# Altium schematic sheet 01_USB_B_and_Power.SchDoc: USB 3.0 Type-B Interface & 3.3 V Power
size A4; DrawnBy: Caoilte Donohoe; Revision: A0; SheetNumber: 1; SheetTotal: 4; Project Name: USB3 Gigabit Ethernet Adapter
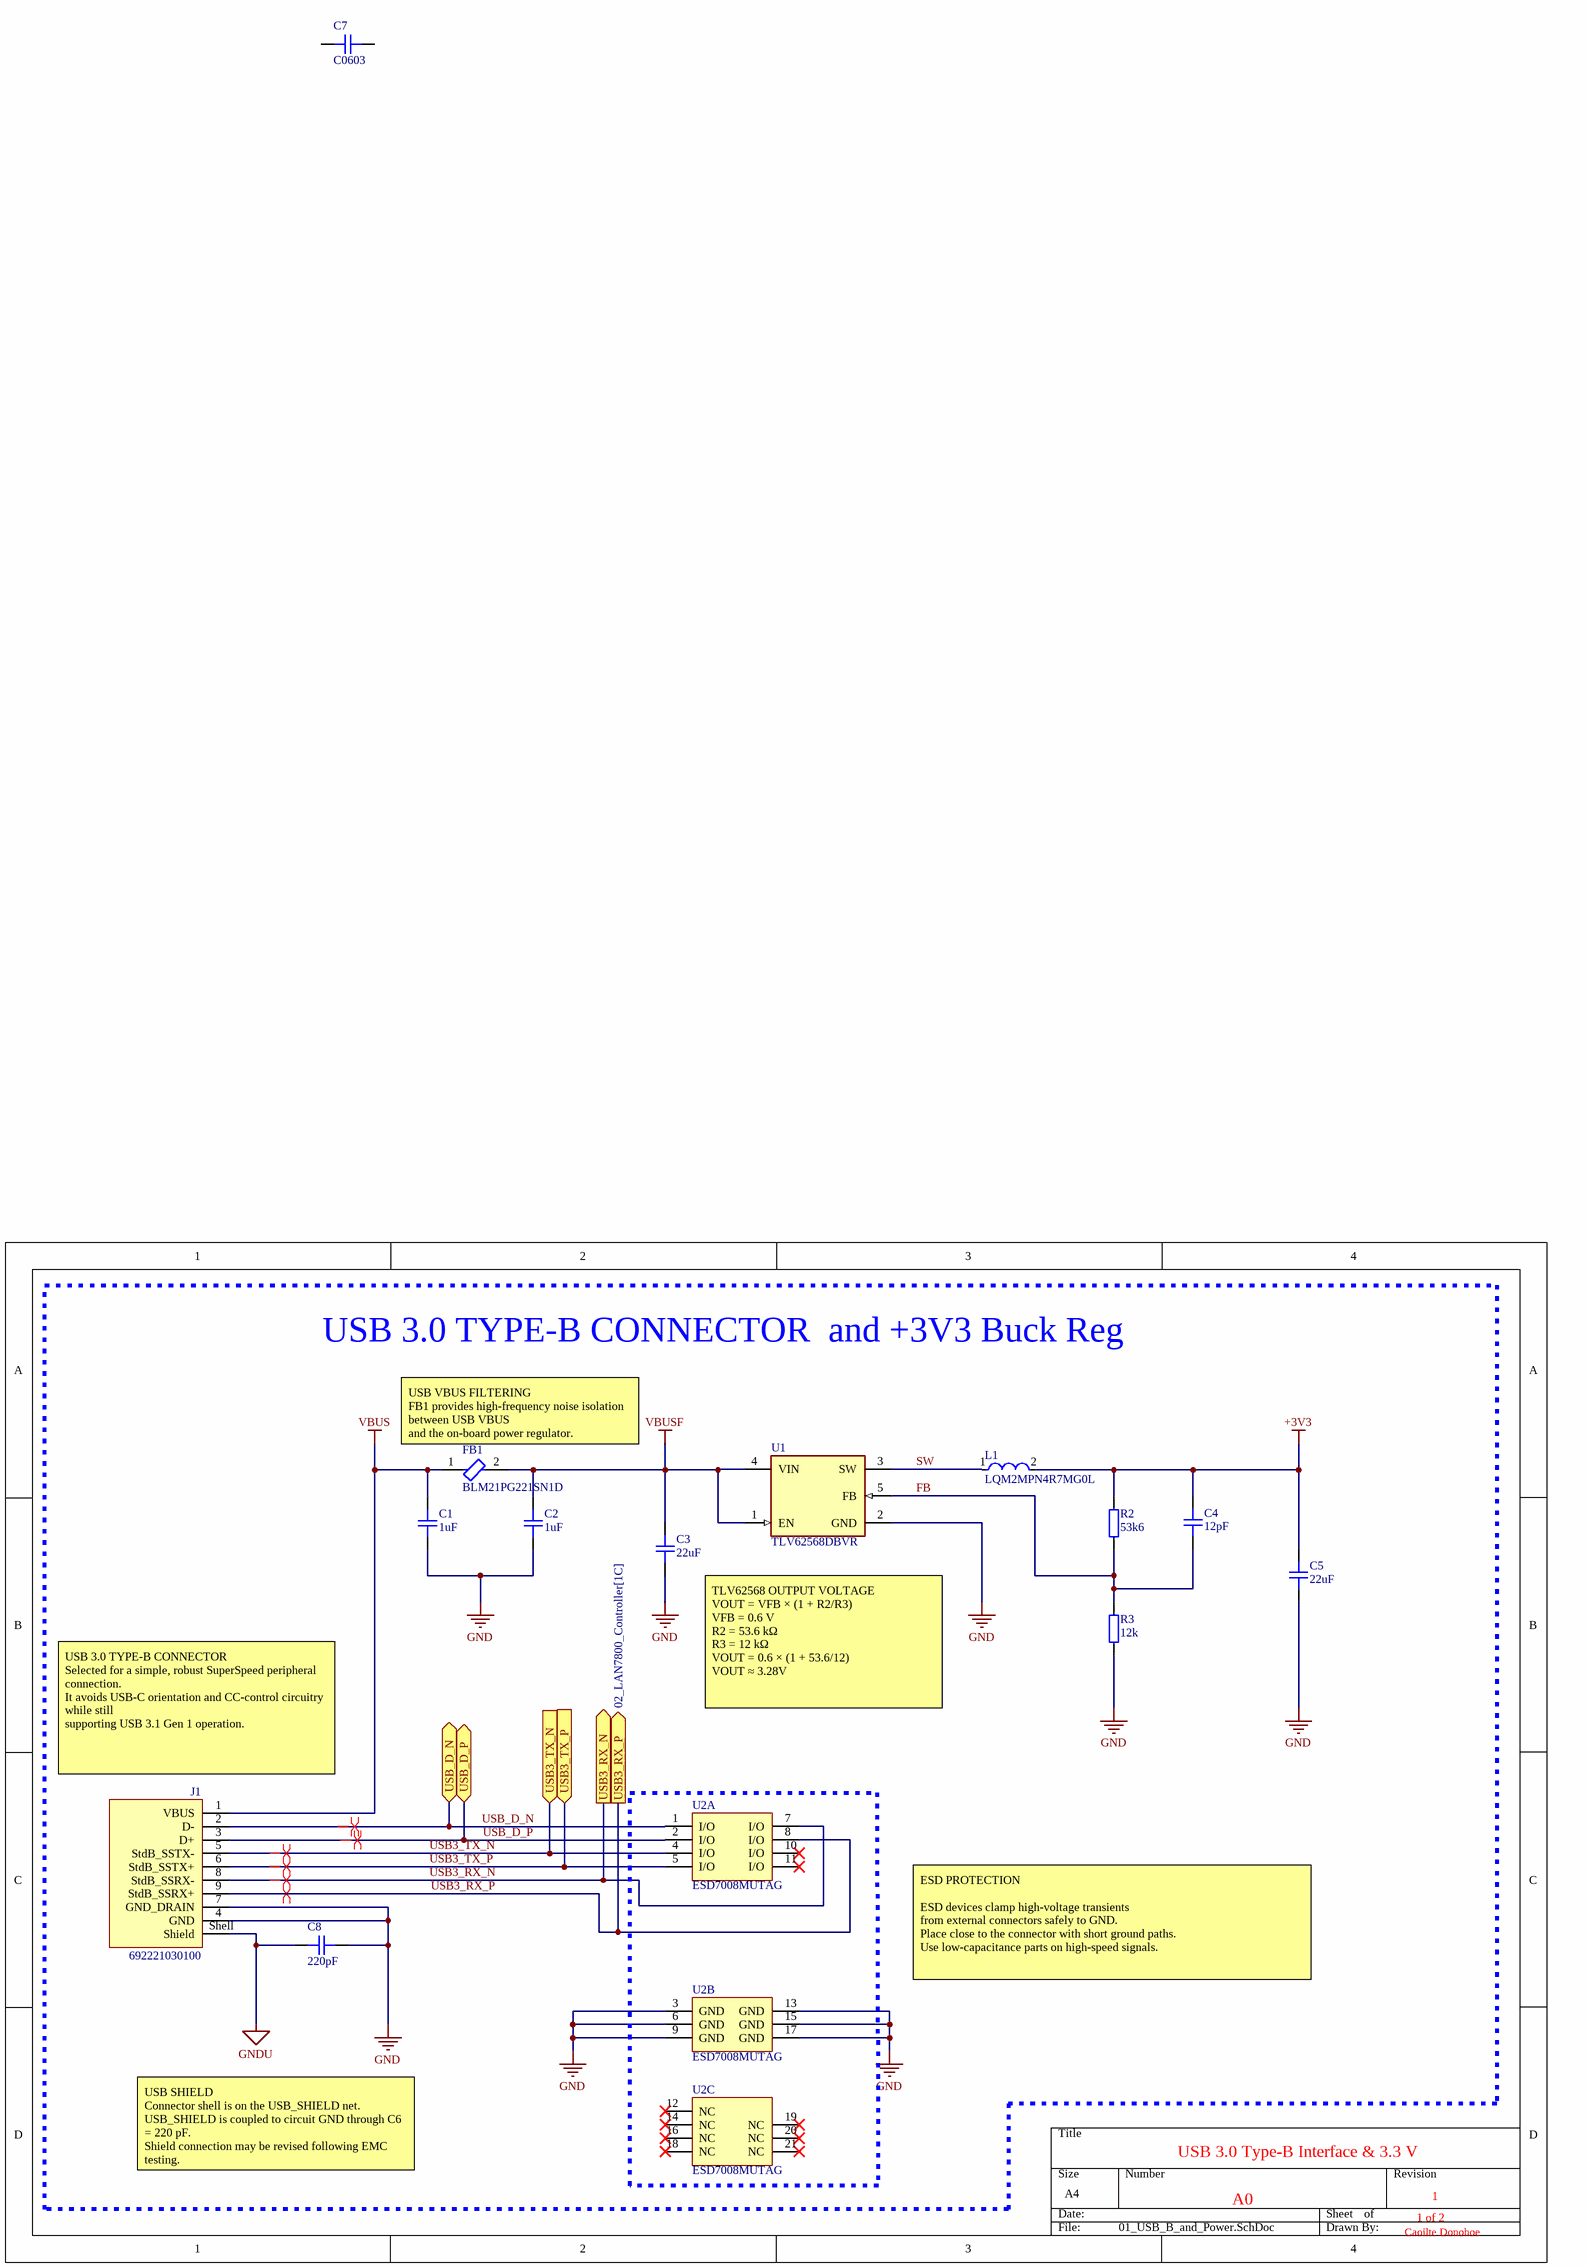
[diagram p0: 01_USB_B_and_Power.SchDoc]

## Parts
C1  1uF  [CAP_0402]
C2  1uF  [CAP_0402]
C3  22uF  [CAP_0805]
C4  12pF  [CAP_0402]
C5  22uF  [CAP_0805]
C6  22pF  [CAP_0603]
C7  C0603  [CAP_0603]
C8  220pF  [CAP_0603]
FB1  BLM21PG221SN1D  [FP-BLM21-0_2-t0_85-e0_5-IPC_C]
J1  692221030100  [692221030100]
L1  LQM2MPN4R7MG0L  [FP-LQM2MPN_G0-IPC_B]
R2  53k6  [RES_0402]
R3  12k  [RES_0402]
U1  TLV62568DBVR  [FP-DBV0005A-MFG]
U2  ESD7008MUTAG  [ONSC-UDFN-18-517BV_V]  (parts A,B,C of 3)

## Ports
USB3_RX_N (out, see 02_LAN7800_Controller[1C]), USB3_RX_P (out, see 02_LAN7800_Controller[1C]), USB3_TX_N (in), USB3_TX_P (in), USB_D_N (bidir, see 02_LAN7800_Controller[1C]), USB_D_P (bidir, see 02_LAN7800_Controller[1C])

## Nets
+3V3: C4.2 C5.2 L1.2 R2.2
GND: C1.1 C2.1 C3.1 C5.1 C8.2 J1.4(GND) J1.7(GND_DRAIN) R3.1 U1.2(GND) U2.3(GND) U2.6(GND) U2.9(GND) U2.13(GND) U2.15(GND) U2.17(GND)
GNDU: C8.1 J1.Shell(Shield)
VBUS: C1.2 FB1.1 J1.1(VBUS)
VBUSF: C2.2 C3.2 FB1.2 U1.1(EN) U1.4(VIN)
FB: C4.1 R2.1 R3.2 U1.5(FB)
SW: L1.1 U1.3(SW)
USB3_RX_N: J1.8(StdB_SSRX-) U2.7(I/O) ; port USB3_RX_N
USB3_RX_P: J1.9(StdB_SSRX+) U2.8(I/O) ; port USB3_RX_P
USB3_TX_N: J1.5(StdB_SSTX-) U2.4(I/O) ; port USB3_TX_N
USB3_TX_P: J1.6(StdB_SSTX+) U2.5(I/O) ; port USB3_TX_P
USB_D_N: J1.2(D-) U2.1(I/O) ; port USB_D_N
USB_D_P: J1.3(D+) U2.2(I/O) ; port USB_D_P

Not connected (* = marked no-connect by the designer): C6 1 2; C7 1 2; U2 10(I/O)* 11(I/O)* 12(NC)* 14(NC)* 16(NC)* 18(NC)* 19(NC)* 20(NC)* 21(NC)*

## Layout directives
differential pair: USB3_RX_N, USB3_RX_P, USB3_TX_N, USB3_TX_P, USB_D_N, USB_D_P

## Notes on the sheet
- USB 3.0 TYPE-B CONNECTOR  and +3V3 Buck Reg
- (near FB1) USB VBUS FILTERING
  FB1 provides high-frequency noise isolation between USB VBUS
  and the on-board power regulator.
- TLV62568 OUTPUT VOLTAGE
  VOUT = VFB × (1 + R2/R3)
  VFB = 0.6 V
  R2 = 53.6 kΩ
  R3 = 12 kΩ
  VOUT = 0.6 × (1 + 53.6/12)
  VOUT ≈ 3.28V
- (near J1) USB 3.0 TYPE-B CONNECTOR
  Selected for a simple, robust SuperSpeed peripheral connection.
  It avoids USB-C orientation and CC-control circuitry while still
  supporting USB 3.1 Gen 1 operation.
- ESD PROTECTION
  ESD devices clamp high-voltage transients
  from external connectors safely to GND.
  Place close to the connector with short ground paths.
  Use low-capacitance parts on high-speed signals.
- USB 3.0 Type-B Interface & 3.3 V Power
- USB SHIELD
  Connector shell is on the USB_SHIELD net.
  USB_SHIELD is coupled to circuit GND through C6 = 220 pF.
  Shield connection may be revised following EMC testing.
- A0
- 1 of 2
- 1
- Caoilte Donohoe

## Library data of the parts
C1 C2 C4 = CAP_0402: Capacitor SMD 0402; Manufacturer: *; Manufacturer Part Number: *; Distributor Link: *; LCSC: *; Rating: *; Dielectric: *
C3 C5 = CAP_0805: Capacitor SMD 0805; Manufacturer: *; Manufacturer Part Number: *; Distributor Link: *; LCSC: *; Rating: *; Dielectric: *
C6-C8 = CAP_0603: Capacitor SMD 0603; Manufacturer: *; Manufacturer Part Number: *; Distributor Link: *; LCSC: *; Rating: *; Dielectric: *
FB1 = CMP-0686-00610-3: Chip Ferrite Bead, 0805, 220Ω @ 100MHz, 0.045Ω, 25%, 2A; Number of Circuits: 1; Shielding: Unshielded; DC Resistance (DCR): 45mR; Impedance: 220R; Radiation Hardening: No; Material: Ferrite; Frequency: 100MHz; Width: 1.25mm; DC Current: 2A; Max DC Current: 2A; Number of Lines: 1; Package Quantity: 1; Case Code (Metric): 2012; Current Rating: 2A; Case/Package: 0805; Current: 2A; Military Standard: Not; Core Material: Ferrite; Depth: 1.25mm; Contact Plating: Tin; DC Resistance-Max: 45mR; Max Operating Temperature: 125°C; Length: 2mm; Max Current Rating: 2A; REACH SVHC: No SVHC; Termination: SMD/SMT; Min Operating Temperature: -55°C; Series: BLM21P; Test Frequency: 100MHz; Tolerance: 25%; Number of Pins: 2; RoHS Compliant: Yes; Height: 0.85mm; Packaging: Tape and Reel; Lead Free: Lead Free; Case Code (Imperial): 0805
J1 = CMP-1502-03224-3: Conn USB 3.0 Type B RCP 9 POS (1.75mm/2.5)mm/1.25mm Solder RA Thru-Hole 9 Terminal 1 Port Tray; Gender: Receptacle; USB Standard: USB 3.0; Insulation Resistance: 100MΩ; Voltage Rating: 30V; Current Rating: 250mA; Number of Contacts: 9; Contact Resistance: 50mΩ; Number of Ports: 1; Max Operating Temperature: 85°C; Contact Plating: Gold; Termination: Through Hole; Orientation: Horizontal; Contact Material: Nickel, Tin; RoHS: Compliant; Min Operating Temperature: -20°C; Flammability Rating: UL94 V-0; Connector Type: USB; Height: 13.05mm; Features: Shielded; Number of Pins: 9; Operating Supply Voltage: 30V; Mount: Horizontal, PCB, Through Hole; Lead Free: Lead Free; Voltage Rating (AC): 30V; Length: 12mm; Width: 18.3mm; Color: Blue
L1 = CMP-06042-016483-1: Multilayer Type Inductor for Power Lines, 0806 (2016), 4.7μH, 20%, 0.175Ω, 1.1A; Self Resonant Frequency: 20MHz; DC Resistance (DCR): 175mR; Test Frequency: 1MHz; Core Material: Ferrite; Shielding: Shielded; Inductance: 4.7uH; Max DC Current: 1.1A; Case Code (Metric): 2016; Min Operating Temperature: -55°C; Military Standard: Not; Depth: 1.75mm; RoHS Compliant: Yes; Packaging: Tape and Reel; Termination: SMD/SMT; Max Operating Temperature: 125°C; Case Code (Imperial): 0806; Width: 0.049inch; Package Quantity: 3000; Length: 0.079inch; DC Current: 1.1A; Mount: Surface Mount; Current Rating: 1.1A; Height - Seated (Max): 0.039inch; Case/Package: 0805; Weight: 0.000353oz; Height: 0.9mm; Tolerance: 20%
R2 R3 = RES_0402: Resistor SMD 0402; Manufacturer: *; Manufacturer Part Number: *; Distributor Link: *; LCSC: *
U1 = CMP-04918-000009-1: IC REG BUCK ADJ 1A SOT23-5; Manufacturer: Texas Instruments; Number Of Outputs: 1; Max Supply Voltage: 5.5V; Nominal Supply Current: 35uA; Standoff Height: 0mm; Max Junction Temp: +125°C; Output Voltage: 0.6-5.5V; Max Duty Cycle: 100%; Output Type: AdjustableProgrammable; Min Supply Voltage: 2.5V; Switching Frequency: 1.5MHz; Height: 1.45mm; Mouser Description: 1-A High Efficiency Synchronous Buck Converter, SMD, 5-pin SOT-23, T/R 3k; Temperature Range High: +125°C; Manufacturer Part Number: TLV62568DBVR; Switching Topology: Buck; ComponentLink2Description: Datasheet; Digikey Description: IC REG BUCK ADJ 1A SOT23-5; Octopart: https://octopart.com/tlv62568dbvr-texas+instruments-76926199; Category: IC; Device Class L1: Integrated Circuits (ICs); RoHS: TRUE; ComponentLink2URL: http://www.ti.com/lit/ds/symlink/tlv62568.pdf; Lead Free: Yes; Package: DBV0005A; Automotive: No; Device Class L2: Power Management ICs; Temperature: -40°C to +125°C; Temperature Range Low: -40°C; Device Class L3: Voltage Regulators - Switching; Output Current: 1A
U2 = CMP-1063-00247-1: Transient Voltage Suppressor, Low Capacitance ESD Protection for High Speed Data, 18-Pin UDFN, Pb-Free, Tape and Reel; Manufacturer: On Semiconductor; VRWM Max (V): 5; V(BR) Min (V): 5.5; Direction: Bidirectional; Number of Lines: 8; IR Max (uA): 1; ComponentLink1Description: Manufacturer URL; PackageReference: UDFN-18-517BV; PackageDescription: 18-Pin Small Outline No-Lead, Body 5.5 x 1.5 mm; PartNumber: ESD7008MUTAG; ComponentLink3URL: http://www.onsemi.cn/pub_link/Collateral/517BV.PDF; PackageVersion: Rev. A, 12/2012; ComponentLink2URL: http://www.onsemi.cn/pub_link/Collateral/ESD7008-D.PDF; DatasheetVersion: Rev. 4; ComponentLink2Description: Datasheet; RoHS: Pb-Free; Packing: Tape and Reel; Mounting Technology: Surface Mount; ComponentLink1URL: http://www.onsemi.com/; ComponentLink3Description: Package Specification